# Altium schematic sheet eink3.schdoc
size A3
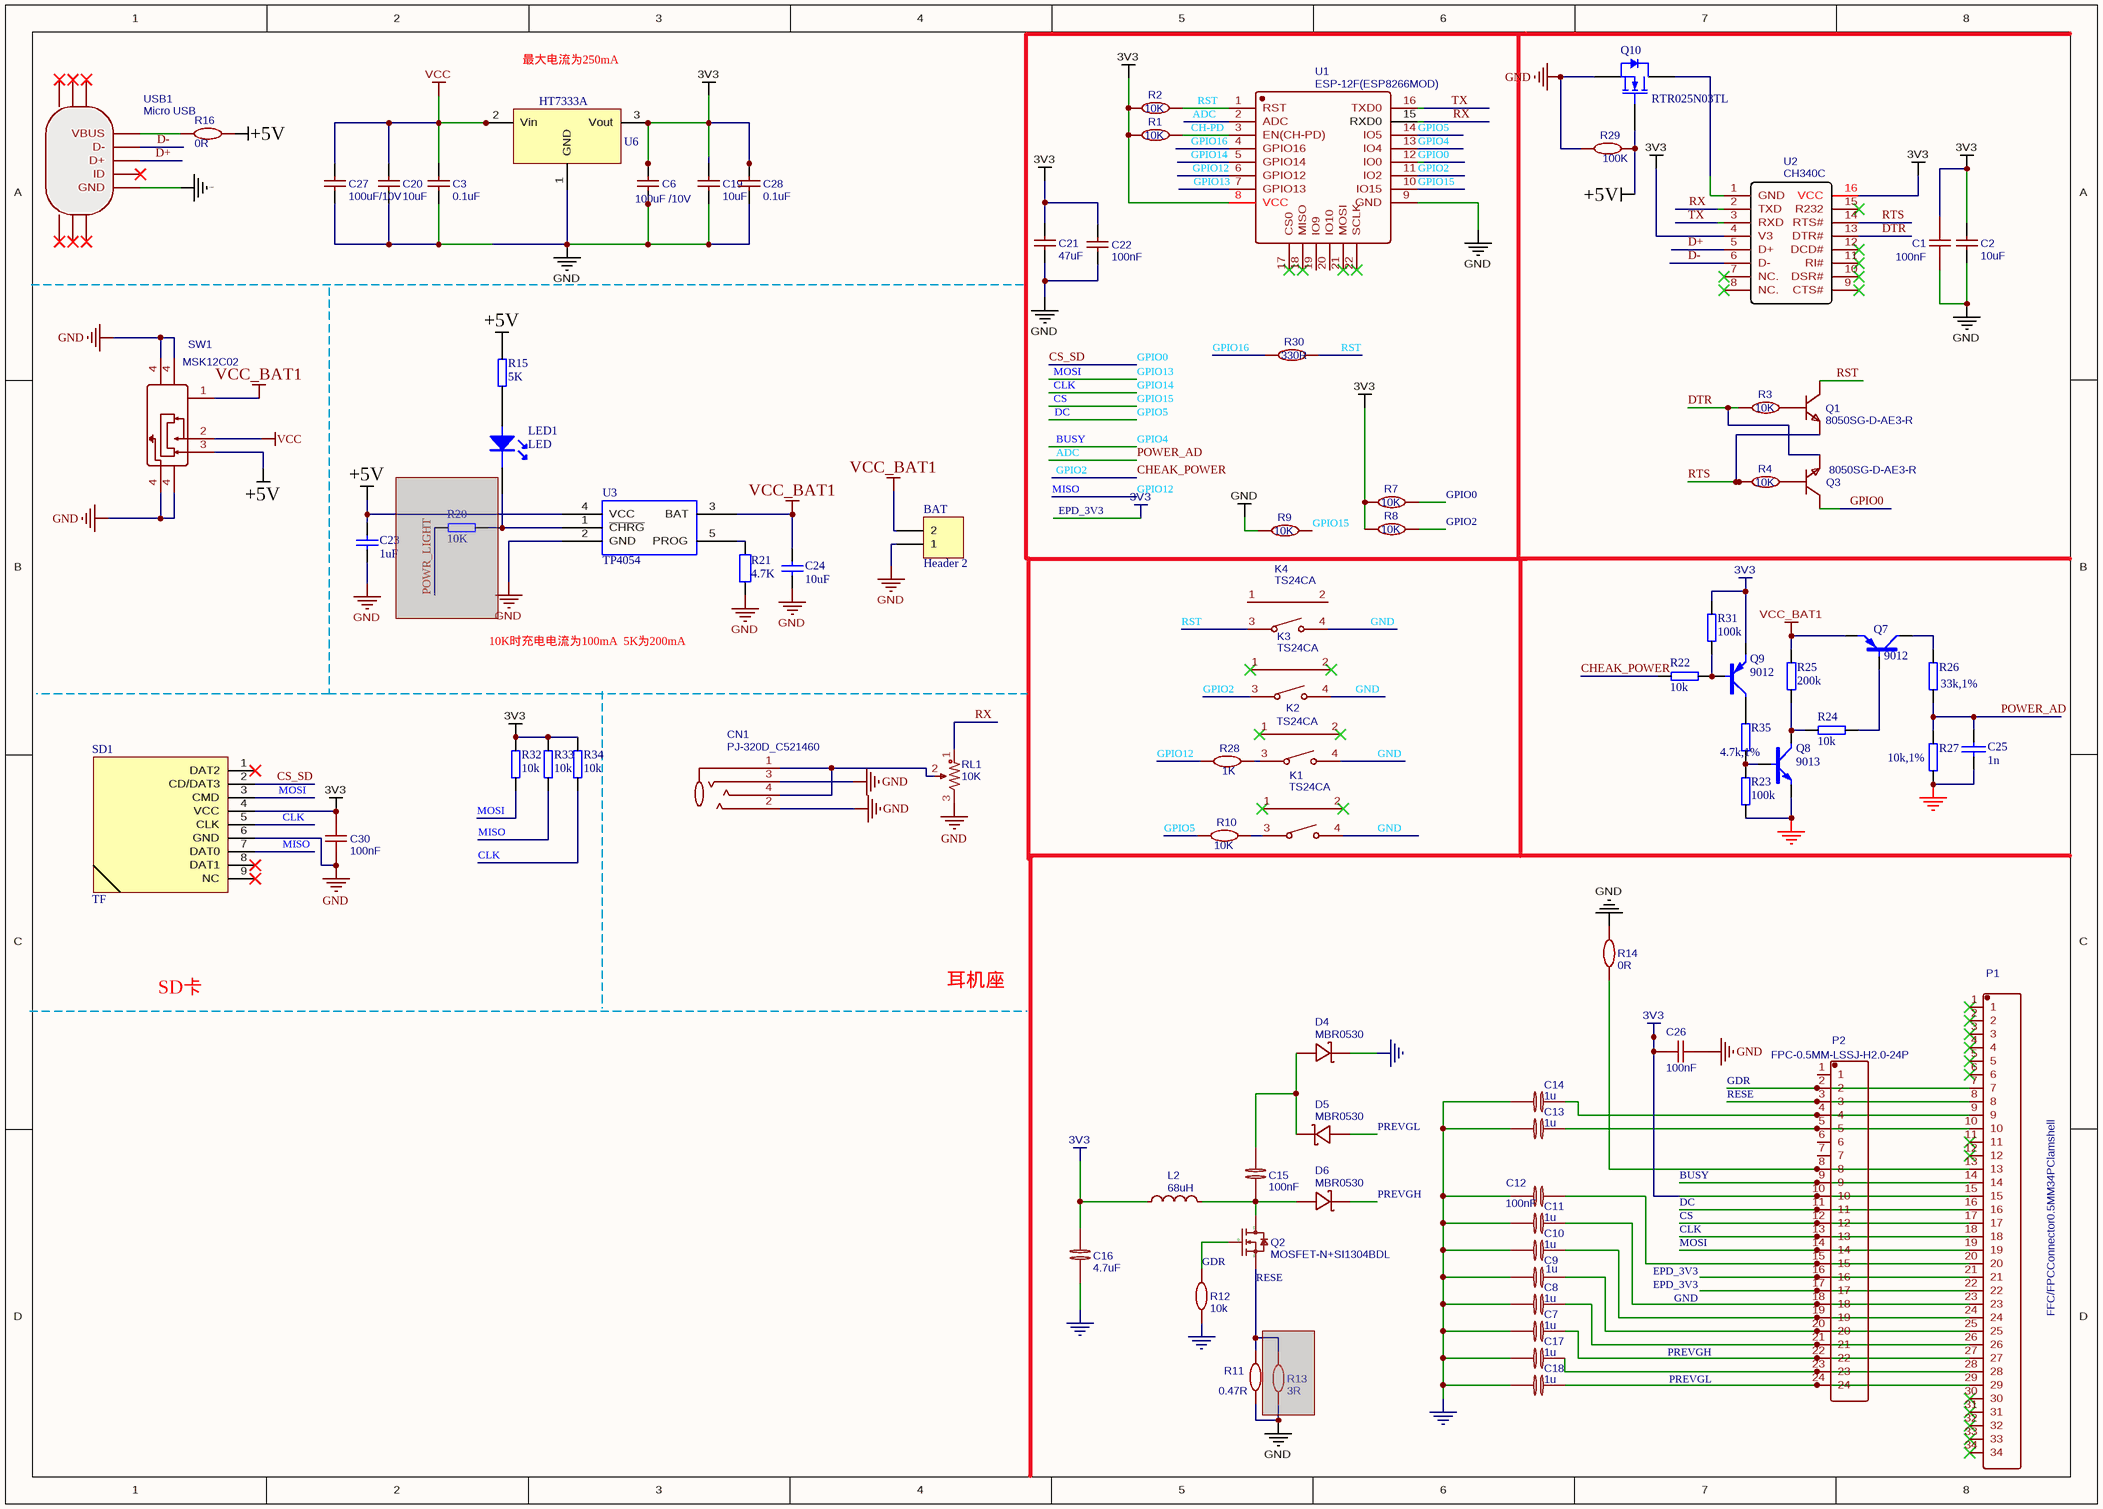
[diagram p0: eink3.schdoc]

## Parts
BAT  Header 2  [HDR1X2]
C1  100nF  [LC-0402_C]
C2  10uF  [LC-0402_C]
C3  0.1uF  [LC-0402_C]
C6  100uF /10V  [C1210]
C7  1u  [LC-0402_C]
C8  1u  [LC-0402_C]
C9  1u  [LC-0402_C]
C10  1u  [LC-0402_C]
C11  1u  [LC-0402_C]
C12  100nF  [LC-0402_C]
C13  1u  [LC-0402_C]
C14  1u  [LC-0402_C]
C15  100nF  [LC-0402_C]
C16  4.7uF  [LC-0402_C]
C17  1u  [LC-0402_C]
C18  1u  [LC-0402_C]
C19  10uF  [LC-0402_C]
C20  10uF  [LC-0402_C]
C21  47uF  [LC-0402_C]
C22  100nF  [LC-0402_C]
C23  1uF  [LC-0402_C]
C24  10uF  [LC-0402_C]
C25  1n  [LC-0402_C]
C26  100nF  [LC-0402_C]
C27  100uF/10V  [C1210]
C28  0.1uF  [LC-0402_C]
C30  100nF  [LC-0402_C]
CN1  PJ-320D_C521460  [AUDIO-SMD_PJ-316A-6A]
D4  MBR0530  [SOD-123]
D5  MBR0530  [SOD-123]
D6  MBR0530  [SOD-123]
K1  TS24CA  [SW-SMD_TS24CA]
K2  TS24CA  [SW-SMD_TS24CA]
K3  TS24CA  [SW-SMD_TS24CA]
K4  TS24CA  [SW-SMD_TS24CA]
L2  68uH  [IND-SMD_L3.5-W3.0]
LED1  LED  [0603-LED]
P1  FFC/FPCConnector0.5MM34PClamshell  [FPC-SMD_34P-L21.5-W5.5-P0.50]
P2  FPC-0.5MM-LSSJ-H2.0-24P  [FPC-0.5MM-LSSJ-H2.0-24P]
Q1  8050SG-D-AE3-R  [SOT-23-3_L2.9-W1.3-P1.90-LS2.4-TR]
Q2  MOSFET-N+SI1304BDL  [SOT-23-3_L2.9-W1.6-P1.90-LS2.8-BR]
Q3  8050SG-D-AE3-R  [SOT-23-3_L2.9-W1.3-P1.90-LS2.4-TR]
Q7  9012  [SOT-23-TRAN]
Q8  9013  [SOT-23-TRAN]
Q9  9012  [SOT-23-TRAN]
Q10  RTR025N03TL  [SOT-23-MOS]
R1  10K  [LC-0402_R]
R2  10K  [LC-0402_R]
R3  10K  [LC-0402_R]
R4  10K  [LC-0402_R]
R7  10K  [LC-0402_R]
R8  10K  [LC-0402_R]
R9  10K  [LC-0402_R]
R10  10K  [LC-0402_R]
R11  0.47R  [R0603]
R12  10k  [LC-0402_R]
R13  3R  [0603]  (masked out: inside a compile mask, not in the netlist)
R14  0R  [LC-0402_R]
R15  5K  [LC-0402_R]
R16  0R  [LC-0402_R]
R20  10K  [LC-0402_R]  (masked out: inside a compile mask, not in the netlist)
R21  4.7K  [LC-0402_R]
R22  10k  [LC-0402_R]
R23  100k  [LC-0402_R]
R24  10k  [LC-0402_R]
R25  200k  [LC-0402_R]
R26  33k,1%  [LC-0402_R]
R27  10k,1%  [LC-0402_R]
R28  1K  [LC-0402_R]
R29  100K  [LC-0402_R]
R30  330R  [LC-0402_R]
R31  100k  [LC-0402_R]
R32  10k  [LC-0402_R]
R33  10k  [LC-0402_R]
R34  10k  [LC-0402_R]
R35  4.7k,1%  [LC-0402_R]
RL1  10K  [2X2 -p3]
SD1  TF  [TF_SD]
SW1  MSK12C02  [SW-TH_MSK12C02]
U1  ESP-12F(ESP8266MOD)  [WIFIM-SMD_ESP-12F-ESP8266MOD]
U2  CH340C  [SOP-16_L10.0-W3.9-P1.27-LS6.0-BL]
U3  TP4054  [LC-SOT-23-5]
U6  HT7333A  [SOT-89]
USB1  Micro USB  [MICRO-USB-1]

## Nets
+5V: C23.1 Q10.G R15.2 R16.1 R29.2 SW1.3 U3.4(VCC)
EPD_3V3: C1.2 C2.2 C6.2 C12.1 C16.1 C19.2 C21.2 C22.2 C26.1 C28.2 C30.1 L2.1 P1.15 P1.20 P1.21 P2.10 P2.15 P2.16 Q9.E R1.1 R2.1 R7.1 R8.1 R31.1 R32.1 R33.1 R34.1 SD1.4(VCC) U1.8(VCC) U2.4(V3) U2.16(VCC) U6.3(Vout)  [also labelled 3V3]
GND: BAT.1 C1.1 C2.1 C3.1 C6.1 C7.2 C8.2 C9.2 C10.2 C11.2 C12.2 C13.2 C14.2 C16.2 C17.2 C18.2 C19.1 C20.1 C21.1 C22.1 C23.2 C24.2 C25.1 C26.2 C27.1 C28.1 C30.2 CN1.2 CN1.3 D4.2(K) K1.4 K2.4 K3.4 K4.4 P1.22 P2.17 Q8.E Q10.S R9.1 R11.2 R12.1 R14.2 R21.1 R23.2 R27.2 R29.1 RL1.3 SD1.6(GND) SW1.4 U1.9(GND) U3.2(GND) U6.1(GND) USB1.5(GND)
VCC: C3.2 C20.2 C27.2 SW1.2 U6.2(Vin)
VCC_BAT1: BAT.2 C24.1 Q7.E R25.2 SW1.1 U3.3(BAT)
ADC: C25.2 R26.2 R27.1 U1.2(ADC)  [also labelled POWER_AD]
BUSY: P1.14 P2.9 U1.13(IO4)  [also labelled GPIO4]
CH-PD: R1.2 U1.3(EN(CH-PD))
CHEAK_POWER: K3.3 R8.2 R22.1 U1.11(IO2)  [also labelled GPIO2]
CLK: P1.18 P2.13 R34.2 SD1.5(CLK) U1.5(GPIO14)  [also labelled GPIO14]
CS: P1.17 P2.12 R9.2 U1.10(IO15)  [also labelled GPIO15]
CS_SD: Q3.3(C) R7.2 SD1.2(CD/DAT3) U1.12(IO0)  [also labelled GPIO0]
D+: U2.5(D+) USB1.3(D+)
D-: U2.6(D-) USB1.2(D-)
DC: P1.16 P2.11 R10.1 U1.14(IO5)  [also labelled GPIO5]
DTR: Q3.1(E) R3.1 U2.13(DTR#)
GDR: P1.7 P2.2 Q2.1(G) R12.2
GPIO12: R28.1 R33.2 SD1.7(DAT0) U1.6(GPIO12)  [also labelled MISO]
GPIO13: P1.19 P2.14 R32.2 SD1.3(CMD) U1.7(GPIO13)  [also labelled MOSI]
GPIO16: R30.1 U1.4(GPIO16)
PREVGH: C8.1 D6.2(K) P1.26 P2.21
PREVGL: C17.1 D5.1(A) P1.28 P2.23
RESE: P1.8 P2.3 Q2.2(S) R11.1
RST: K4.3 Q1.3(C) R2.2 R30.2 U1.1(RST)
RTS: Q1.1(E) R4.1 U2.14(RTS#)
RX: RL1.1 U1.15(RXD0) U2.2(TXD)
TX: U1.16(TXD0) U2.3(RXD)
NetC7_1: C7.1 P1.27 P2.22
NetC9_1: C9.1 P1.25 P2.20
NetC10_1: C10.1 P1.24 P2.19
NetC11_1: C11.1 P1.23 P2.18
NetC13_1: C13.1 P1.10 P2.5
NetC14_1: C14.1 P1.9 P2.4
NetC15_1: C15.1 D4.1(A) D5.2(K)
NetC15_2: C15.2 D6.1(A) L2.2 Q2.3(D)
NetC18_1: C18.1 P1.29 P2.24
NetCN1_1: CN1.1 CN1.4 RL1.2
NetK1_3: K1.3 R10.2
NetK2_3: K2.3 R28.2
NetLED1_A: LED1.A R15.1
NetLED1_K: LED1.K U3.1(~{CHRG})
NetP1_13: P1.13 P2.8 R14.1
NetQ1_2: Q1.2(B) R3.2
NetQ3_2: Q3.2(B) R4.2
NetQ7_B: Q7.B R24.1
NetQ7_C: Q7.C R26.1
NetQ8_B: Q8.B R23.1 R35.2
NetQ8_C: Q8.C R24.2 R25.1
NetQ9_B: Q9.B R22.2 R31.2
NetQ9_C: Q9.C R35.1
NetQ10_D: Q10.D U2.1(GND)
NetR16_2: R16.2 USB1.1(VBUS)
NetR21_2: R21.2 U3.5(PROG)

Not connected (* = marked no-connect by the designer): K1 1* 2*; K2 1* 2*; K3 1* 2*; K4 1 2; P1 1* 2* 3* 4* 5* 6* 11* 12* 30* 31* 32* 33* 34*; P2 1 6 7; SD1 1(DAT2)* 8(DAT1)* 9(NC)*; U1 17(CS0)* 18(MISO)* 19(IO9) 20(IO10) 21(MOSI)* 22(SCLK)*; U2 7(NC.)* 8(NC.)* 9(CTS#)* 10(DSR#)* 11(RI#)* 12(DCD#)* 15(R232)*; USB1 0(MTN4)* 4(ID)*

## Notes on the sheet
- 最大电流为250mA
- 10K时充电电流为100mA  5K为200mA
- 耳机座
- SD卡

## Library data of the parts
BAT = Header 2: Header, 2-Pin; LatestRevisionDate: 17-Jul-2002; LatestRevisionNote: Re-released for DXP Platform.; Publisher: Altium Limited
C1 C26 C30 = 100nF: BOM_Manufacturer: MuRata; BOM_Manufacturer Part: GRM188B11E104KA01D; nameAlias: Capacitance; BOM_Supplier: LCSC; BOM_Supplier Part: C85986; spicePre: C; spiceSymbolName: GRM188B11E104KA01D
C2 C3 C6 C19-C22 C27 C28 = 10uF: BOM_Manufacturer: FH; BOM_Manufacturer Part: 0603X106K100NT; nameAlias: Capacitance; BOM_Supplier: LCSC; BOM_Supplier Part: C38898; spicePre: C; spiceSymbolName: 0603X106K100NT
C7-C11 C13 C14 C17 C18 = 1u: nameAlias: Value(F); BOM_Manufacturer Part: ?; spicePre: C; spiceSymbolName: Capacitor
C12 C15 = 0.1u: nameAlias: Value(F); BOM_Manufacturer Part: ?; spicePre: C; spiceSymbolName: Capacitor
C16 = 4.7uF: nameAlias: Value(F); BOM_Manufacturer Part: ?; spicePre: C; spiceSymbolName: Capacitor
C23 C24 = Cap: 1uF/16V/X7R/0603
C25 = CAP: 无极性电容
CN1 = PJ-320D_C521460: BOM_Manufacturer: USAKRO; Contributor: LCSC; BOM_Supplier: LCSC; BOM_Supplier Part: C521460; BOM_Manufacturer Part: PJ-320D; BOM_JLCPCB Part Class: Extended Part; spicePre: C; spiceSymbolName: PJ-320D_C521460
K1-K4 = TS24CA: BOM_Manufacturer: SHOU HAN; Contributor: LCSC; BOM_Supplier: LCSC; BOM_Supplier Part: C393942; BOM_Manufacturer Part: TS24CA; spicePre: S; spiceSymbolName: TS24CA
L2 = 68uH: BOM_Manufacturer: SXN; BOM_Manufacturer Part: SM3521-680MT; nameAlias: Inductance; BOM_Supplier: LCSC; BOM_Supplier Part: C72424; spicePre: L; spiceSymbolName: SM3521-680MT
LED1 = LED: LED/红色/0603
P1 = FFC/FPCConnector0.5MM34PClamshell: BOM_Manufacturer: BOOMELE; Contributor: 立创EDA官方封装库; spicePre: X; BOM_Supplier: LCSC; BOM_Manufacturer Part: FFC/FPCConnector0.5MM34PClamshell; image: //image.lceda.cn/szlcsc/C28328.jpg; BOM_Supplier Part: C28328; spiceSymbolName: FFC/FPCConnector0.5MM34PClamshell
Q1 Q3 = 8050SG-D-AE3-R: BOM_Manufacturer: UTC; SMT Type: Extend; BOM_Supplier: LCSC; BOM_Manufacturer Part: 8050SG-D-AE3-R; image: //image.lceda.cn/szlcsc/C73207.jpg; BOM_Supplier Part: C73207; BOM_LCSC Assembly: Yes; spicePre: Q; spiceSymbolName: 8050SG-D-AE3-R
Q2 = MOSFET-N+SI1304BDL: catid: 20; BOM_Manufacturer Part: ?; spicePre: Q
Q7 Q9 = PNP-S: PNP Transistor
Q8 = NPN-S: NPN Transistor
Q10 = MOS-N: N-channel  MOSFET
R1-R4 R7-R10 R28-R30 = 10K: BOM_Manufacturer: YAGEO; BOM_Manufacturer Part: RT0603DRD0710KL; nameAlias: Resistance (Ohms); Contributor: LCSC; BOM_Supplier: LCSC; BOM_Supplier Part: C136944; spicePre: R; spiceSymbolName: RT0603DRD0710KL
R11 = 0.47R: nameAlias: Value(Ω); BOM_Manufacturer Part: ?; spicePre: R; spiceSymbolName: Resistor
R12-R14 R16 = 10k: nameAlias: Value(Ω); BOM_Manufacturer Part: ?; spicePre: R; spiceSymbolName: Resistor
R15 R20 R22-R27 R31-R35 = RES
R21 = Res2: 4.7K/1% /0402
RL1 = 47K: BOM_Manufacturer: BOURNS; BOM_Manufacturer Part: 3386P-1-473LF; nameAlias: Resistance (Ohms); BOM_Supplier: LCSC; BOM_Supplier Part: C116292; Resistance(Ohms): 47K; BOM_JLCPCB Part Class: Extended Part; spicePre: R; spiceSymbolName: 3386P-1-473LF
SD1 = MiniSD
SW1 = MSK12C02: BOM_Manufacturer: SHOU HAN; Contributor: LCSC; BOM_Supplier: LCSC; BOM_Supplier Part: C431540; BOM_Manufacturer Part: MSK12C02; spicePre: S; spiceSymbolName: MSK12C02
U1 = ESP-12F(ESP8266MOD): BOM_Manufacturer: Ai-Thinker; BOM_Supplier: LCSC; BOM_Manufacturer Part: ESP-12F(ESP8266MOD); BOM_Supplier Part: C82891; spicePre: U; spiceSymbolName: ESP-12F(ESP8266MOD)
U2 = CH340C: BOM_Manufacturer: WCH; SMT Type: Extend; BOM_Supplier: LCSC; BOM_Manufacturer Part: CH340C; BOM_Supplier Part: C84681; BOM_LCSC Assembly: Yes; spicePre: U; spiceSymbolName: CH340C
U3 = Component_1
U6 = VOLTRER1
USB1 = Micro USB: BOM_Manufacturer: LCSC; BOM_Manufacturer Part: micro 5P 0.2; BOM_Supplier: LCSC; spicePre: U; BOM_Supplier Part: C40945
D4-D6 = MBR0530: BOM_Supplier: LCSC; BOM_Manufacturer Part: MBR0530; spicePre: D; BOM_Supplier Part: C77336
P2 = FPC-0.5MM-LSSJ-H2.0-24P: spicePre: X; BOM_Supplier: LCSC; BOM_Manufacturer Part: ?; BOM_Supplier Part: C11092